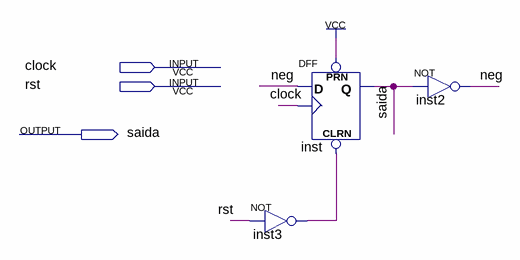
[diagram p0: schematic sheet]
// Quartus schematic dff1bt.bdf as structural Verilog: 3 symbols, 3 pins
module dff1bt (
  input  clock,
  input  rst,
  output saida
);

  wire inst3_out, neg;

  not inst3 (inst3_out, rst);
  DFF inst (.CLRN(inst3_out), .CLK(clock), .D(neg), .PRN(1'b1), .Q(saida));
  not inst2 (neg, saida);
endmodule
